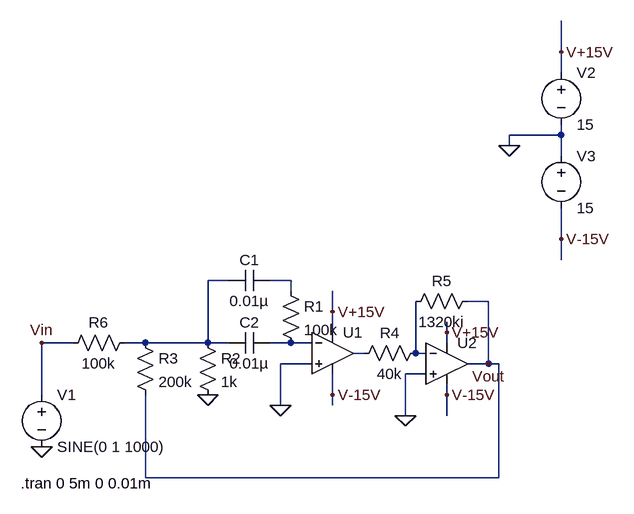
[diagram p0: schematic ActivieBP.asc]
ActivieBP.asc, the LTspice schematic file:
Version 4.1
SHEET 1 880 680
WIRE 544 -240 544 -288
WIRE 544 -208 544 -240
WIRE 544 -112 544 -128
WIRE 544 -112 464 -112
WIRE 464 -96 464 -112
WIRE 544 -80 544 -112
WIRE 544 48 544 0
WIRE 544 80 544 48
WIRE 32 112 0 112
WIRE 128 112 96 112
WIRE 128 128 128 112
WIRE 432 144 400 144
WIRE 192 160 192 128
WIRE 192 192 192 160
WIRE 368 192 368 176
WIRE -208 208 -256 208
WIRE -96 208 -128 208
WIRE 0 208 0 112
WIRE 0 208 -96 208
WIRE 32 208 0 208
WIRE 128 208 96 208
WIRE 160 208 128 208
WIRE 368 208 368 192
WIRE 240 224 224 224
WIRE 320 224 320 144
WIRE 336 224 320 224
WIRE 160 240 112 240
WIRE 432 240 432 144
WIRE 432 240 400 240
WIRE 448 240 432 240
WIRE 336 256 304 256
WIRE -256 288 -256 208
WIRE 192 288 192 256
WIRE 368 288 368 272
WIRE 112 304 112 240
WIRE 192 304 192 288
WIRE 304 320 304 256
WIRE 368 320 368 288
WIRE -96 416 -96 288
WIRE 448 416 448 240
WIRE 448 416 -96 416
FLAG 112 304 0
FLAG 304 320 0
FLAG -256 368 0
FLAG -256 208 Vin
FLAG 432 240 Vout
FLAG 464 -96 0
FLAG 544 -240 V+15V
FLAG 544 48 V-15V
FLAG 368 192 V+15V
FLAG 192 160 V+15V
FLAG 368 288 V-15V
FLAG 192 288 V-15V
FLAG 0 288 0
SYMBOL OpAmps\\UniversalOpAmp 192 224 R0
SYMATTR InstName U1
SYMBOL cap 96 96 R90
WINDOW 0 0 32 VBottom 2
WINDOW 3 32 32 VTop 2
SYMATTR InstName C1
SYMATTR Value 0.01µ
SYMBOL cap 96 192 R90
WINDOW 0 0 32 VBottom 2
WINDOW 3 32 32 VTop 2
SYMATTR InstName C2
SYMATTR Value 0.01µ
SYMBOL res 112 112 R0
SYMATTR InstName R1
SYMATTR Value 100k
SYMBOL res -16 192 R0
SYMATTR InstName R2
SYMATTR Value 1k
SYMBOL res -112 192 R0
SYMATTR InstName R3
SYMATTR Value 200k
SYMBOL res 336 208 R90
WINDOW 0 0 56 VBottom 2
WINDOW 3 32 56 VTop 2
SYMATTR InstName R4
SYMATTR Value 40k
SYMBOL res 416 128 R90
WINDOW 0 0 56 VBottom 2
WINDOW 3 32 56 VTop 2
SYMATTR InstName R5
SYMATTR Value 1320ki
SYMBOL OpAmps\\UniversalOpAmp 368 240 R0
SYMATTR InstName U2
SYMBOL res -112 192 R90
WINDOW 0 0 56 VBottom 2
WINDOW 3 32 56 VTop 2
SYMATTR InstName R6
SYMATTR Value 100k
SYMBOL voltage -256 272 R0
WINDOW 123 0 0 Left 0
WINDOW 39 0 0 Left 0
SYMATTR InstName V1
SYMATTR Value SINE(0 1 1000)
SYMBOL voltage 544 -224 R0
WINDOW 123 0 0 Left 0
WINDOW 39 0 0 Left 0
SYMATTR InstName V2
SYMATTR Value 15
SYMBOL voltage 544 -96 R0
WINDOW 123 0 0 Left 0
WINDOW 39 0 0 Left 0
SYMATTR InstName V3
SYMATTR Value 15
TEXT -288 424 Left 2 !.tran 0 5m 0 0.01m

The netlist it stands for:
* ActivieBP.asc
X§U1 0 N003 V+15V V-15V N004 level1 Avol=1Meg GBW=10Meg Vos=0 En=0 Enk=0 In=0 Ink=0 Rin=500Meg  ; pins In+ In- V+ V- OUT
C1 N002 N001 0.01µ
C2 N003 N001 0.01µ
R1 N002 N003 100k
R2 N001 0 1k
R3 N001 Vout 200k
R4 N005 N004 40k
R5 Vout N005 1320ki
X§U2 0 N005 V+15V V-15V Vout level1 Avol=1Meg GBW=10Meg Vos=0 En=0 Enk=0 In=0 Ink=0 Rin=500Meg  ; pins In+ In- V+ V- OUT
R6 N001 Vin 100k
V1 Vin 0 SINE(0 1 1000)
V2 V+15V 0 15
V3 0 V-15V 15
.tran 0 5m 0 0.01m
.lib UniversalOpAmp1.lib
.backanno
.end